# EAGLE design blinkercough (EAGLE 7.3.0)
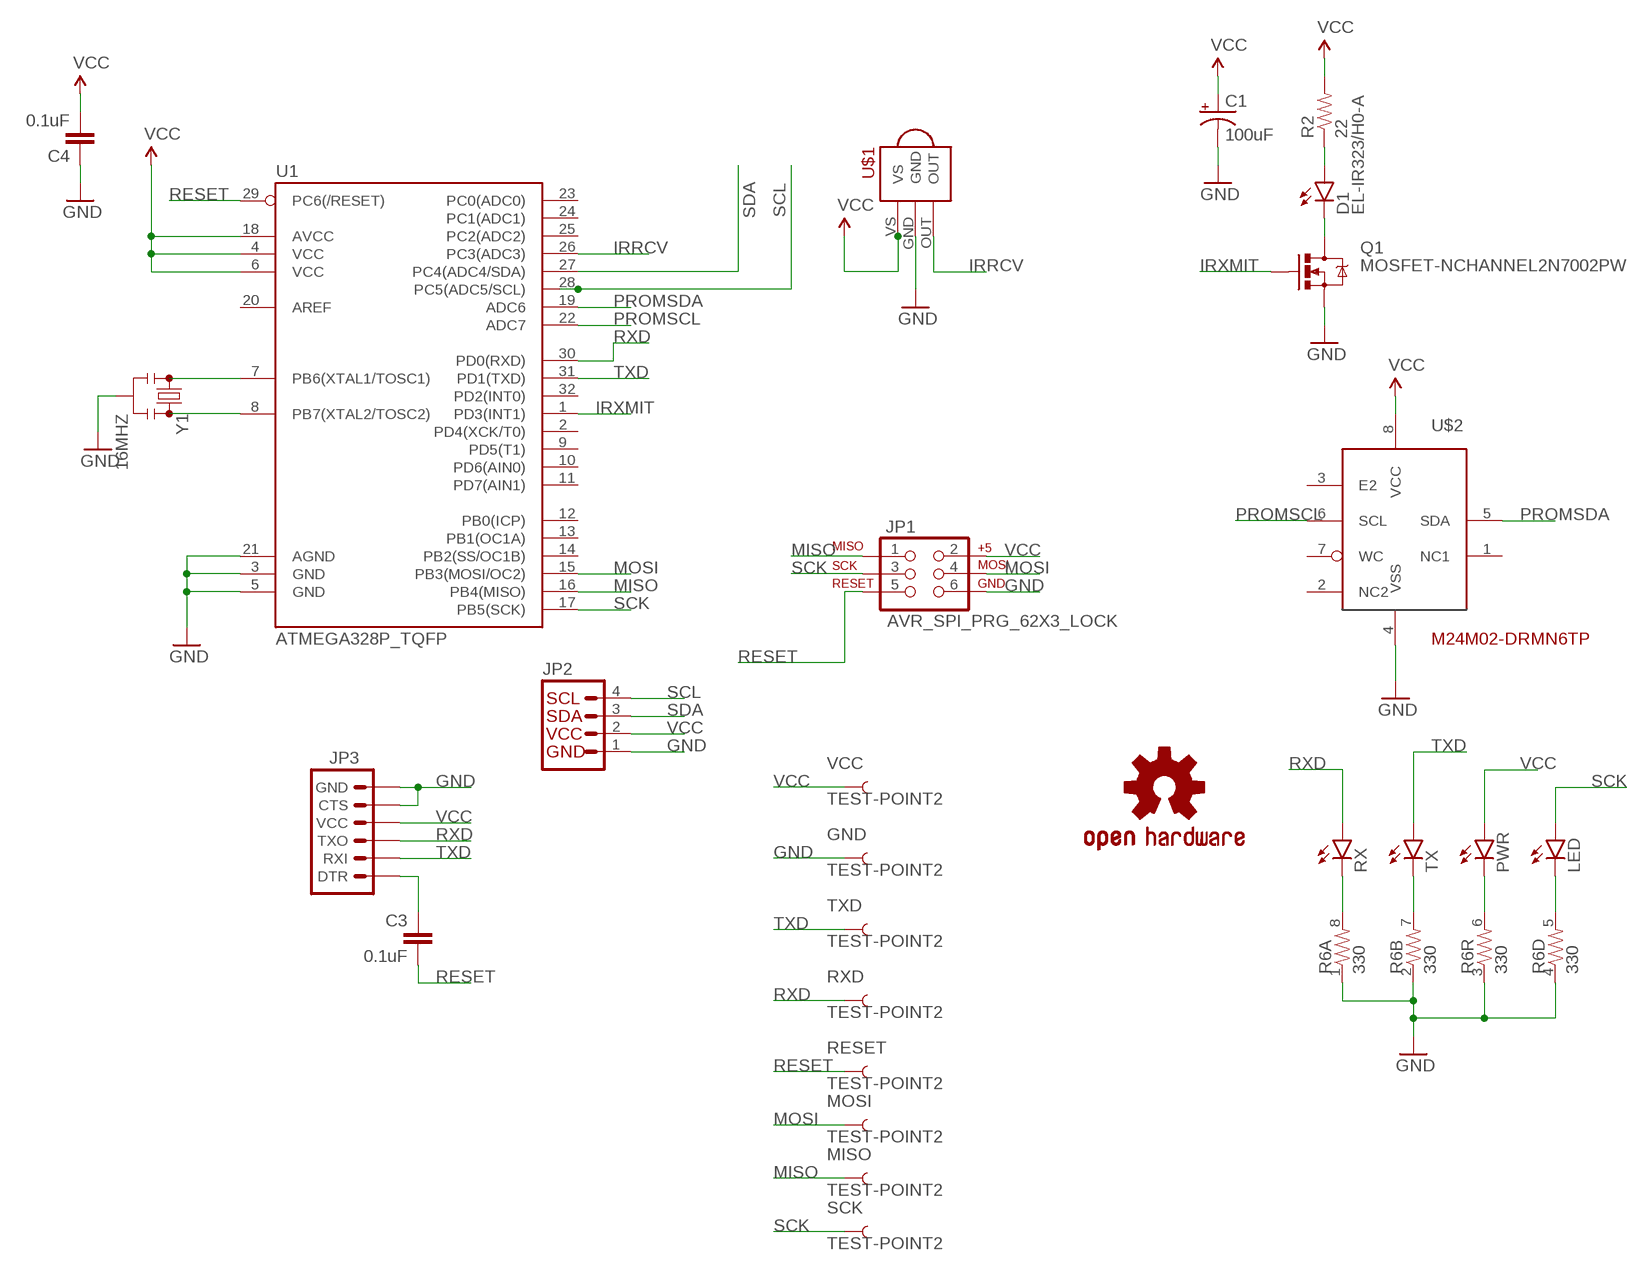
[diagram p0: schematic, sheet 1]

## Parts
C1  100uF  100UF-10V-10%(TANT)  [EIA7343]
C3  0.1uF  0.1UF-25V(+80/-20%)(0603)  [0603-CAP]
C4  0.1uF  0.1UF-25V(+80/-20%)(0603)  [0603-CAP]
D1  EL-IR323/H0-A  LED3MM  [LED3MM]
GND  TEST-POINT2  [PAD.02X.02]
JP1  AVR_SPI_PRG_62X3_LOCK  [2X3_LOCK]
JP2  I2C_STANDARD  [1X04]
JP3  ARDUINO_SERIAL_PROGRAMLOCK  [1X06_LOCK]
LED  LED0603  [LED-0603]
LOGO1  OSHW-LOGOS  [OSHW-LOGO-S]
MISO  TEST-POINT2  [PAD.02X.02]
MOSI  TEST-POINT2  [PAD.02X.02]
PWR  LED0603  [LED-0603]
Q1  MOSFET-NCHANNEL2N7002PW  [SOT323]
R2  22  RESISTOR1206  [1206]
R6  330  RESISTOR-ARRAY0603-ARV  [0603-ARV]
RESET  TEST-POINT2  [PAD.02X.02]
RX  LED0603  [LED-0603]
RXD  TEST-POINT2  [PAD.02X.02]
SCK  TEST-POINT2  [PAD.02X.02]
TX  LED0603  [LED-0603]
TXD  TEST-POINT2  [PAD.02X.02]
U1  ATMEGA328P_TQFP  [TQFP32-08]
U$1  TSOP2438  [TSOP2438]
U$2  M24M02-DRMN6TP  [SO8]
VCC  TEST-POINT2  [PAD.02X.02]
Y1  16MHZ  RESONATOR16MHZ  [RESONATOR-SMD]

## Nets
GND [power]: C1.C(-) C4.1 GND.P$1 JP1.6 JP2.1 JP3.5(CTS) JP3.6(GND) Q1.2(S) R6.1 R6.2 R6.3 R6.4 U1.3(GND) U1.5(GND) U1.21(AGND) U$1.GND U$2.4(VSS) Y1.2
IRRCV: U1.26(PC3(ADC3)) U$1.OUT
IRXMIT: Q1.1(G) U1.1(PD3(INT1))
LED: LED.C R6.5
MISO: JP1.1 MISO.P$1 U1.16(PB4(MISO))
MOSI: JP1.4 MOSI.P$1 U1.15(PB3(MOSI/OC2))
N$1: U1.7(PB6(XTAL1/TOSC1)) Y1.1
N$2: U1.8(PB7(XTAL2/TOSC2)) Y1.3
N$3: R6.8 RX.C
N$5: C3.1 JP3.1(DTR)
N$6 [power]: D1.K(C) Q1.3(D)
N$7 [power]: D1.A R2.1
N$9: R6.7 TX.C
PROMSCL: U1.22(ADC7) U$2.6(SCL)
PROMSDA: U1.19(ADC6) U$2.5(SDA)
PWR: PWR.C R6.6
RESET: C3.2 JP1.5 RESET.P$1 U1.29(PC6(/RESET))
RXD: JP3.3(TXO) RX.A RXD.P$1 U1.30(PD0(RXD))
SCK: JP1.3 LED.A SCK.P$1 U1.17(PB5(SCK))
SCL: JP2.4 U1.28(PC5(ADC5/SCL))
SDA: JP2.3 U1.27(PC4(ADC4/SDA))
TXD: JP3.2(RXI) TX.A TXD.P$1 U1.31(PD1(TXD))
VCC [power]: C1.A(+) C4.2 JP1.2 JP2.2 JP3.4(VCC) PWR.A R2.2 U1.4(VCC) U1.6(VCC) U1.18(AVCC) U$1.VS U$2.8(VCC) VCC.P$1
Unconnected: U1.2(PD4(XCK/T0)) U1.9(PD5(T1)) U1.10(PD6(AIN0)) U1.11(PD7(AIN1)) U1.12(PB0(ICP)) U1.13(PB1(OC1A)) U1.14(PB2(SS/OC1B)) U1.20(AREF) U1.23(PC0(ADC0)) U1.24(PC1(ADC1)) U1.25(PC2(ADC2)) U1.32(PD2(INT0)) U$2.1(NC1) U$2.2(NC2) U$2.3(E2) U$2.7(WC)

## Library data of the parts
C1 = SparkFun-Capacitors:100UF-10V-10%(TANT): CAP-07890; PROD_ID: CAP-07890
C3 C4 = SparkFun-Capacitors:0.1UF-25V(+80/-20%)(0603): CAP-00810 Ceramic Standard decoupling cap; PROD_ID: CAP-00810
D1 LED PWR RX TX = SparkFun-LED:LED: LEDs Standard schematic elements and footprints for 5mm, 3mm, 1206, and 0603 sized LEDs. 5mm - Spark Fun Electronics SKU : COM-00529 (and others)
GND MISO MOSI RESET RXD SCK TXD VCC = SparkFun-Passives:TEST-POINT: Bare copper test points for troubleshooting or ICT
JP1 = SparkFun-Connectors:AVR_SPI_PRG_6: AVR ISP 6 Pin This is the reduced ISP connector for AVR programming. Common on Arduino. This footprint will take up less PCB space and can be used with a 10-pin to 6-pin adapter such as SKU: BOB-08508 **Special note about "TEST_POINT" package. The stop mask is on the top side, so if you want your programming test points to be on the bottom of your board, make sure to place this package on the bottom side of the board. This also ensure that the orientation to program from the bottom side will be correct.
JP2 = SparkFun-Connectors:I2C_STANDARD: SparkFun has standardized on a pinout for all I2C based sensor breakouts. This pinout allows I2C boards to be plugged directly into the headers on Arduino Uno compatible boards, and to be daisy chained easily.
JP3 = SparkFun-Connectors:ARDUINO_SERIAL_PROGRAM: FTDI connector footprints
LOGO1 = SparkFun-Aesthetics:OSHW-LOGO: Open Source Hardware Logo This logo indicates the piece of hardware it is found on incorporates a OSHW license and/or adheres to the definition of open source hardware found here: http://freedomdefined.org/OSHW
Q1 = SparkFun-DiscreteSemi:MOSFET-NCHANNEL: Common NMOSFET Parts MFG P/N Store ID Prod ID FDD8780 TRANS-09984 SI7820DN TRANS-11055 FDS6630A IC-08089 2N7002PW TRANS-11151 FQP30N06L COM-10213 TRANS-10060 BSS123LT1G TRANS-08345 BSS138 TRANS-00830 BS170 2N7000; PROD_ID: TRANS-11151
R2 = SparkFun-Resistors:RESISTOR: Resistor Basic schematic elements and footprints for 0603, 1206, and PTH resistors.
R6 = SparkFun-Resistors:RESISTOR-ARRAY: Array Chip Resistor Source: RS Component / Phycomp
U1 = SparkFun-DigitalIC:ATMEGA328P_TQFP; PROD_ID: IC-09069
U$1 = ioh-1:TSOP2438
U$2 = untitled:M24M02-DRMN6TP: EEPROM 2 Mbit serial I2C 1.8V to 5.5V EEPROM
Y1 = SparkFun-FreqCtrl:RESONATOR: Resonator Small SMD resonator. Used, eg, on the Arduino Pro/ Pro Mini boards. 8MHz- XTAL-08895 16MHz- XTAL-08900; PROD_ID: XTAL-08900

## Net classes
1 power: width 0.203 mm

## Board
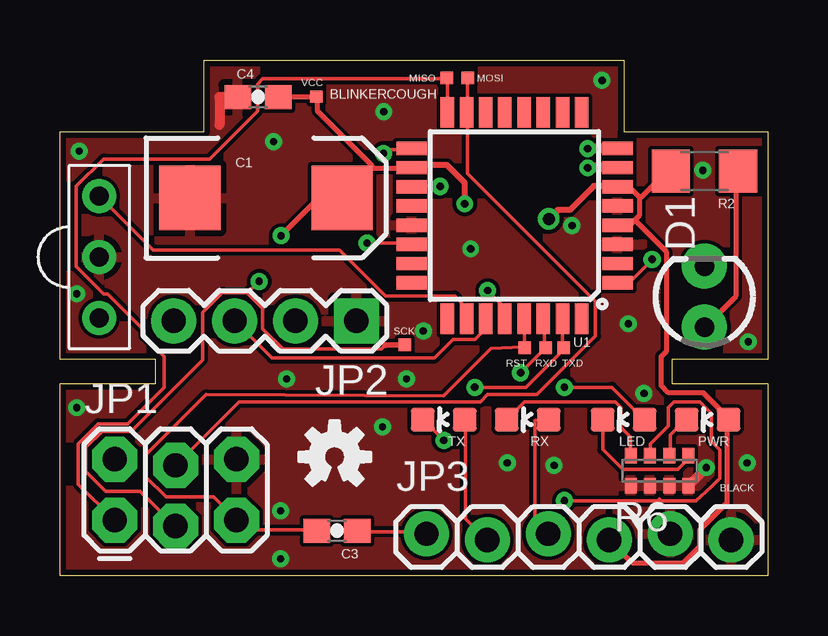
[diagram p1: board, top side]
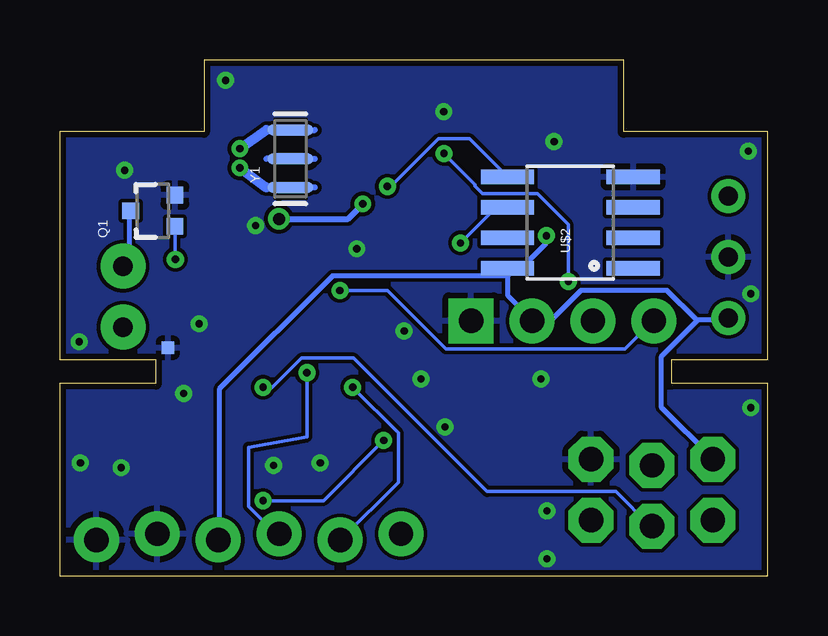
[diagram p2: board, bottom side, seen from below]

Size 29.5 x 21.5 mm. Coordinates in mm from the lower left corner, seen from the top.
Outline: 0,0 0,8 4,8 4,9 0,9 0,18.5 6,18.5 6,21.5 23.5,21.5 23.5,18.5 29.5,18.5 29.5,9 25.5,9 25.5,8 29.5,8 29.5,0 0,0
Copper layers (1*16): Top 0.035mm / dielectric 1.5mm / Bottom 0.035mm
Design rules "DFRobot_Eagle_Rule_v0.4": minimum track width 6mil, minimum drill 12mil, track to track 6mil, track to pad 6mil, pad to pad 6mil, via to via 6mil, smd to smd 0mil, copper to edge 10mil, drill to drill 10mil, minimum pad ring 12mil, minimum via ring 8mil, stop-mask expansion 2mil, vias tented up to drill 25mil, thermal gap 10mil

### Footprints (pad centres in the part's own frame; a part is rotated, then mirrored left to right if it is on the bottom)
EIA7343 = smd 2.55 x 2.7: A 3.17,0; C -3.17,0
0603-CAP = smd 1.1 x 1: 1 -0.85,0; 2 0.85,0
LED3MM = drill 0.813 pad 1.88: A -1.27,0; K 1.27,0
PAD.02X.02 = smd 0.508 x 0.508: P$1 0,0
2X3_LOCK = drill 1.016 pad 1.88 octagon: 1 0,0; 2 0,2.54; 3 2.54,-0.254; 4 2.54,2.286; 5 5.08,0; 6 5.08,2.54
1X04 = drill 1.016 pad 1.88 square: 1 0,0 | drill 1.016 pad 1.88: 2 2.54,0; 3 5.08,0; 4 7.62,0
1X06_LOCK = drill 1.016 pad 1.88: 1 0,0; 2 2.54,-0.254; 3 5.08,0; 4 7.62,-0.254; 5 10.16,0; 6 12.7,-0.254
LED-0603 = smd 1 x 1: A 0,-0.877; C 0,0.877
SOT323 = smd 0.7 x 0.7: 1 -0.65,-0.925; 2 0.65,-0.925; 3 0,0.925
1206 = smd 1.6 x 1.8: 1 -1.4,0; 2 1.4,0
0603-ARV = smd 0.5 x 0.65: 1 -1.2,-0.625; 2 -0.4,-0.625; 3 0.4,-0.625; 4 1.2,-0.625; 5 1.2,0.625; 6 0.4,0.625; 7 -0.4,0.625; 8 -1.2,0.625
TQFP32-08 = smd 1.27 x 0.559: 1 -4.293,2.8; 2 -4.293,2; 3 -4.293,1.2; 4 -4.293,0.4; 5 -4.293,-0.4; 6 -4.293,-1.2; 7 -4.293,-2; 8 -4.293,-2.8; 17 4.293,-2.8; 18 4.293,-2; 19 4.293,-1.2; 20 4.293,-0.4; 21 4.293,0.4; 22 4.293,1.2; 23 4.293,2; 24 4.293,2.8 | smd 0.559 x 1.27: 9 -2.8,-4.293; 10 -2,-4.293; 11 -1.2,-4.293; 12 -0.4,-4.293; 13 0.4,-4.293; 14 1.2,-4.293; 15 2,-4.293; 16 2.8,-4.293; 25 2.8,4.293; 26 2,4.293; 27 1.2,4.293; 28 0.4,4.293; 29 -0.4,4.293; 30 -1.2,4.293; 31 -2,4.293; 32 -2.8,4.293
TSOP2438 = drill 0.8: GND 0,0; OUT -2.54,0; VS 2.54,0
SO8 = smd 0.61 x 2.21: 1 -1.905,-2.616; 2 -0.635,-2.616; 3 0.635,-2.616; 4 1.905,-2.616; 5 1.905,2.616; 6 0.635,2.616; 7 -0.635,2.616; 8 -1.905,2.616
RESONATOR-SMD = smd 0.45 x 1.905: 1 -1.2,0; 2 0,0; 3 1.2,0

### Placement (x,y rotation side)
C1  8.59,15.75 0 top
C3  11.55,1.87 180 top
C4  8.26,19.95 0 top
D1  26.87,11.63 90 top
GND  25,9.5 0 bottom
JP1  2.28,2.31 0 top
JP2  12.36,10.62 180 top
JP3  15.28,1.74 0 top
LED  23.5,6.5 90 top
LOGO1  11.45,4.95 0 top
MISO  16.12,20.75 0 top
MOSI  17,20.75 0 top
PWR  27,6.5 90 top
Q1  25.63,15.21 90 bottom
R2  26.87,16.86 180 top
R6  25,4.38 0 top
RESET  19.38,9.5 0 top
RX  19.5,6.5 90 top
RXD  20.25,9.5 0 top
SCK  14.38,9.62 0 top
TX  16,6.5 90 top
TXD  21,9.5 0 top
U1  18.95,15.01 180 top
U$1  1.64,13.28 270 top
U$2  8.22,14.72 90 bottom
VCC  10.69,19.96 0 top
Y1  19.89,17.38 90 bottom

### Tracks (layer width: path | path; a pad name or v marks a point on that pad's centre or on a via)
GND  (via drill 0.3)
  Top 0.406: C4.1 6.65,19.95 6.65,18.8 | v26.95,4.5 R6.4
  other vias: 13.5,19.35 0.8,17.7 0.7,11.75 22.6,20.65 23.7,10.5 28.7,9.75 18.65,4.7 13.45,6.2 0.7,7 9.2,0.7 28.65,4.7 8.9,18.1 26.8,16.9 21.35,14.6 14.45,8.2 9.45,8.2 15.15,10.2 9.2,2.7 20.6,4.6 24.35,7.6 17.12,13.62
  pour Bottom: 0,0 30,0 30,22 0,22
  pour Top: 0,0 30,0 30,22 0,22
IRRCV
  Top 0.152: U1.26 16.92,10.74 16.92,11.2 16.46,11.66 13.56,11.66 11.66,13.56 3.89,13.56 1.68,15.77 U$1.OUT
IRXMIT  (via drill 0.3)
  Top 0.152: v24.69,13.18 23.77,12.27 23.32,12.27 U1.1
  Bottom 0.152: v24.69,13.18 Q1.1
LED
  Top 0.152: R6.5 26.14,4.95 26.14,4.8 25.76,4.42 23.47,4.42 22.63,5.26 22.63,6.48 LED.C
MISO
  Top 0.152: U1.16 16.15,19.36 16.15,20.73 MISO.P$1 16.08,20.73 8.46,20.73 8.23,20.5 8.23,19.36 6.25,17.37 1.83,17.37 0.69,16.23 0.69,12.88 1.83,11.73 1.98,11.73 3.5,10.21 3.5,9.98 4.34,9.14 4.34,7.85 2.82,6.33 1.6,6.33 0.76,5.49 0.76,3.81 2.21,2.36 JP1.1
MOSI
  Top 0.152: MOSI.P$1 16.99,20.73 16.99,19.36 U1.15 16.99,19.28 16.99,16.76 22.33,11.43 22.33,9.98 19.89,7.54 17.83,7.54 17.53,7.24 7.47,7.24 4.88,4.65 JP1.4
N$1  (via drill 0.3)
  Top 0.406: U1.7 v22,17.01 v22,17
  Bottom 0.406: v22,17 20.91,16.18
N$2  (via drill 0.3)
  Top 0.406: U1.8 v22,17.8
  Bottom 0.406: v22,17.8 20.91,18.58
N$3
  Top 0.152: R6.8 23.77,5.03 23.77,5.79 23.39,6.17 23.39,7.01 23.16,7.24 19.36,7.24 18.67,6.55 RX.C
N$5
  Top 0.152: C3.1 12.42,1.83 15.16,1.83 15.24,1.75 JP3.1
N$6
  Bottom 0.203: Q1.3 26.59,15.16 26.59,13.18 26.82,12.95 D1.K
N$7
  Top 0.203: R2.1 28.19,16.84 28.19,11.66 26.9,10.36 D1.A
N$8  (via drill 0.3)
  other vias: 20.38,14.88
N$9  (via drill 0.3)
  Top 0.15: 27.15,6.76 27.15,5.6 27.5,5.25 27.5,4.06 27.15,3.71
  Top 0.152: 27.15,6.76 26.67,7.24 25.6,7.24 25.38,7.01 25.38,6.25 24.61,5.49 24.61,5.03 R6.7 | 27.15,3.71 26.52,3.12 25.07,3.12 24.99,3.2 24.92,3.12 v21.03,3.12 | v16,5.64 15.16,6.48 TX.C
  Bottom 0.152: v21.03,3.12 18.52,3.12 v16,5.64
PROMSCL  (via drill 0.3)
  Top 0.152: v12.8,13.87 14.63,13.87 U1.22
  Bottom 0.152: v12.8,13.87 11.35,15.32 10.9,15.32 U$2.6
PROMSDA  (via drill 0.3)
  Top 0.152: v15.85,16.23 14.71,16.23 U1.19
  Bottom 0.152: v15.85,16.23 15.7,16.23 13.72,18.21 12.42,18.21 10.9,16.69 U$2.5
PWR
  Top 0.152: R6.6 25.45,5.03 25.45,5.87 26.06,6.48 PWR.C
RESET
  Top 0.152: U1.29 19.36,10.67 19.36,9.53 RESET.P$1 19.28,9.53 17.98,9.47 15.99,7.49 6.1,7.54 3.58,5.03 3.58,4.12 4.42,3.28 6.4,3.28 7.32,2.36 JP1.5 7.39,2.29 7.77,1.91 10.67,1.91 C3.2
RXD  (via drill 0.3)
  Top 0.152: U1.30 20.19,10.67 20.19,9.53 RXD.P$1 20.19,9.45 v19.2,8.46 | RX.A 19.8,6.48 19.8,1.75 JP3.3
  Bottom 0.152: v19.2,8.46 19.2,5.79 21.64,5.35 21.64,2.9 20.42,1.68 JP3.3
SCK  (via drill 0.3)
  Top 0.152: 13.56,9.6 13.41,9.45 9.3,9.45 8.46,10.29 8.46,11.12 7.81,11.77 | 7.81,11.77 7.77,11.81 6.78,11.81 5.94,10.97 5.94,8.99 2.97,6.02 1.75,6.02 1.07,5.33 1.07,4.34 1.91,3.5 3.35,3.5 4.8,2.06 JP1.3 | v21.03,7.85 23.01,7.85 24.31,6.55 LED.A | v13.49,17.6 13.64,17.75 14.63,17.75 U1.17 | 7.81,11.77 v8.31,12.27
  Top 0.254: SCK.P$1 13.56,9.6
  Bottom 0.152: v21.03,7.85 20.65,7.85 19.43,9.07 17.26,9.07 11.7,3.5 6.33,3.5 4.88,2.06 JP1.3 | v13.49,17.6 12.19,16.31 12.19,16.23 11.89,15.93 9.6,15.93 8.31,14.63 v8.31,12.27
SCL  (via drill 0.3)
  Top 0.152: v17.83,11.89 18.52,11.2 18.52,10.74 U1.28
  Bottom 0.152: v17.83,11.89 15.85,11.89 13.41,9.45 5.94,9.45 4.8,10.59 JP2.4
SDA
  Top 0.15: 15.61,9.07 16.39,9.85 17.3,9.85 17.75,10.3 U1.27
  Top 0.152: 15.61,9.07 8.84,9.07 7.32,10.59 JP2.3 | 17.68,10.67 U1.27
TXD  (via drill 0.3)
  Top 0.152: U1.31 20.95,10.67 20.95,9.53 TXD.P$1 20.95,9.45 20.8,9.3 20.8,9.22 19.43,7.85 v17.3,7.85 | TX.A 16.92,6.48 16.92,2.36 17.75,1.52 JP3.2
  Bottom 0.152: v17.3,7.85 15.39,5.94 15.39,3.89 17.75,1.52 JP3.2
VCC  (via drill 0.3, 0.5)
  Top 0.203: 23.96,14.82 24.16,15.01 24.16,15.77 | 23.96,14.82 23.77,14.63 23.32,14.63 U1.4 | 24.16,15.77 23.77,16.15 23.32,16.15 U1.6 | R2.2 25.45,16.84 25.3,16.84 24.23,15.77 24.16,15.77 | JP3.4 22.94,1.45 23.85,0.53 25.98,0.53 26.67,1.22 26.67,1.91 27.81,3.05 27.81,6.48 PWR.A 27.89,6.55 26.82,7.62 25.38,7.62 25.07,7.92 25.07,9.14 25.3,9.37 25.3,13.49 23.96,14.82 | C4.2 9.14,19.96 10.67,19.96 VCC.P$1 10.74,19.89 10.74,19.36 13.03,17.07 C1.A | U1.18 14.63,16.99 13.03,16.99 11.81,15.77 C1.A | v9.22,14.17 10.82,15.77 11.66,15.77 C1.A
  Top 0.254: v16.88,15.5 16.88,16.38 16.12,17.12 15.12,17.12 15,17 | 23,16.25 22.25,16.25 21.25,15.25 20.75,15.25 v20.38,14.88
  Top 0.406: 23,16.25 23.24,16.25 U1.6
  Bottom 0.203: 10.82,12.5 10.82,11.66 9.83,10.67 JP2.2 9.75,10.67 8.99,10.67 7.77,11.89 4.19,11.89 2.97,10.67 2.9,10.67 | 10.82,12.5 10.82,12.8 U$2.8 10.74,12.8 10.29,12.8 9.22,13.87 v9.22,14.17 | 2.9,10.67 1.68,10.67 U$1.VS | 2.9,10.67 4.42,9.14 4.42,7.01 2.29,4.88 JP1.2 | 10.82,12.5 18.14,12.5 22.86,7.77 22.86,1.52 JP3.4
  Bottom 0.254: v20.38,14.88 17.5,14.88 v16.88,15.5

### Text on the board
tPlace: VCC | MISO | MOSI | BLINKERCOUGH | SCK | RST | RXD | TXD | BLACK